# Altium schematic sheet Sheet3.SchDoc
size A4; SheetNumber: 1; SheetTotal: 1
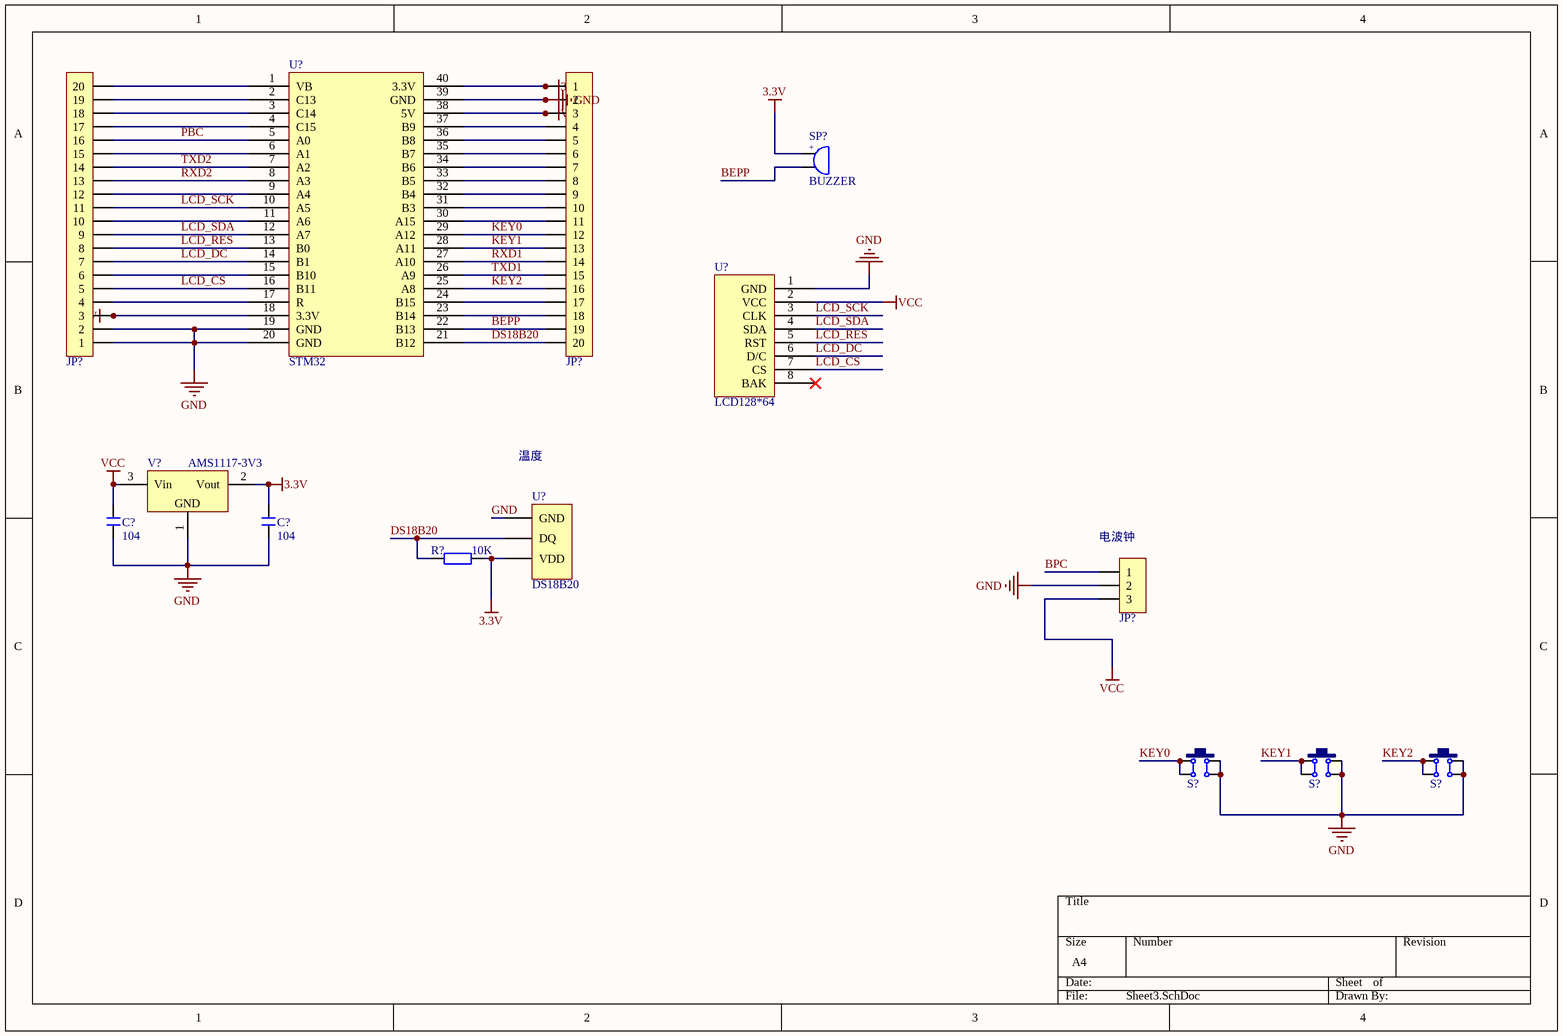
[diagram p0: Sheet3.SchDoc]

## Parts
(Parts that share a designator on the sheet are numbered #1, #2 ... from top to bottom, then left to right.)
C?#1  104  [C 0805_M]
C?#2  104  [C 0805_M]
JP?#1  HDR-1X20  [HDR2.54-LI-20P]  (value not drawn)
JP?#2  HDR-1X20  [HDR2.54-LI-20P]  (value not drawn)
JP?#3  HDR-1X3  [HDR2.54-LI-3P]  (value not drawn)
R?  10K  [R 0805_M]
S?#1  6x6x5  [TSW DIP-6*6*5]  (value not drawn)
S?#2  6x6x5  [TSW DIP-6*6*5]  (value not drawn)
S?#3  6x6x5  [TSW DIP-6*6*5]  (value not drawn)
SP?  BUZZER  [BEEP 6.5x12x6]
U?#1  STM32  [STM32 mirco]
U?#2  LCD128*64  [LCD128*64]
U?#3  DS18B20  [TO92A]
V?  AMS1117-3V3  [SOT223_L]

## Nets
3.3V: C?#2.2 JP?#1.1 JP?#2.3 R?.2 SP?.1 U?#1.18(3.3V) U?#1.40(3.3V) U?#3.3(VDD) V?.2(Vout)
GND: C?#1.1 C?#2.1 JP?#1.2 JP?#2.1 JP?#2.2 JP?#3.2 S?#1.2 S?#1.3 S?#2.2 S?#2.3 S?#3.2 S?#3.3 U?#1.19(GND) U?#1.20(GND) U?#1.39(GND) U?#2.1(GND) U?#3.1(GND) V?.1(GND)
VCC: C?#1.2 JP?#1.3 JP?#3.3 U?#1.38(5V) U?#2.2(VCC) V?.3(Vin)
BEPP: JP?#1.19 SP?.2 U?#1.22(B13)
BPC: JP?#3.1
DS18B20: JP?#1.20 R?.1 U?#1.21(B12) U?#3.2(DQ)
KEY0: JP?#1.12 S?#1.1 S?#1.4 U?#1.29(A12)
KEY1: JP?#1.13 S?#2.1 S?#2.4 U?#1.28(A11)
KEY2: JP?#1.16 S?#3.1 S?#3.4 U?#1.25(A8)
LCD_CS: JP?#2.5 U?#1.16(B11) U?#2.7(CS)
LCD_DC: JP?#2.7 U?#1.14(B1) U?#2.6(D/C)
LCD_RES: JP?#2.8 U?#1.13(B0) U?#2.5(RST)
LCD_SCK: JP?#2.11 U?#1.10(A5) U?#2.3(CLK)
LCD_SDA: JP?#2.9 U?#1.12(A7) U?#2.4(SDA)
PBC: JP?#2.16 U?#1.5(A0)
RXD1: JP?#1.14 U?#1.27(A10)
RXD2: JP?#2.13 U?#1.8(A3)
TXD1: JP?#1.15 U?#1.26(A9)
TXD2: JP?#2.14 U?#1.7(A2)
NetJP?#1_4: JP?#1.4 U?#1.37(B9)
NetJP?#1_5: JP?#1.5 U?#1.36(B8)
NetJP?#1_6: JP?#1.6 U?#1.35(B7)
NetJP?#1_7: JP?#1.7 U?#1.34(B6)
NetJP?#1_8: JP?#1.8 U?#1.33(B5)
NetJP?#1_9: JP?#1.9 U?#1.32(B4)
NetJP?#1_10: JP?#1.10 U?#1.31(B3)
NetJP?#1_11: JP?#1.11 U?#1.30(A15)
NetJP?#1_17: JP?#1.17 U?#1.24(B15)
NetJP?#1_18: JP?#1.18 U?#1.23(B14)
NetJP?#2_4: JP?#2.4 U?#1.17(R)
NetJP?#2_6: JP?#2.6 U?#1.15(B10)
NetJP?#2_10: JP?#2.10 U?#1.11(A6)
NetJP?#2_12: JP?#2.12 U?#1.9(A4)
NetJP?#2_15: JP?#2.15 U?#1.6(A1)
NetJP?#2_17: JP?#2.17 U?#1.4(C15)
NetJP?#2_18: JP?#2.18 U?#1.3(C14)
NetJP?#2_19: JP?#2.19 U?#1.2(C13)
NetJP?#2_20: JP?#2.20 U?#1.1(VB)

Not connected (* = marked no-connect by the designer): U?#2 8(BAK)*

## Notes on the sheet
- 温度
- (near JP?#3) 电波钟
- (in symbol BEEP) +

## Library data of the parts
C?#1 C?#2 = C: 无极性贴片电容; 版权归属: 源创客; BOM名称: 无极性贴片电容; 学习资源: www.ooocke.com
JP?#1 JP?#2 = Header 20: 20P接插件; 版权归属: 源创客; BOM名称: 20P接插件; 学习资源: www.ooocke.com
JP?#3 = Header 3: 3P接插件; 版权归属: 源创客; BOM名称: 3P接插件; 学习资源: www.ooocke.com
R? = R-CRR: 直插色环电阻; BOM名称: 色环电阻; 版权归属: 源创客; 学习资源: www.ooocke.com
S?#1-S?#3 = TSW SMD-6x6: 贴片6x6轻触开关; 版权归属: 源创客; BOM名称: 贴片6x6轻触开关; 学习资源: www.ooocke.com
SP? = BEEP: 蜂鸣器; 版权归属: 源创客; BOM名称: 蜂鸣器; 学习资源: www.ooocke.com
U?#1 = STM32 MIRCO: STM32F103C8T6最小系统
U?#2 = LCD128*64: 老王家 9648LCD液晶屏 带背光FM1720390CT6
U?#3 = DS18B20: 数字温度计; 版权归属: 源创客; BOM名称: 数字温度计; 学习资源: www.ooocke.com
V? = AMS1117: 三端稳压芯片; BOM名称: 稳压芯片; 版权归属: 源创客; 学习资源: www.ooocke.com